# Altium schematic sheet 售烟机上限位电路板.SchDoc
size A4
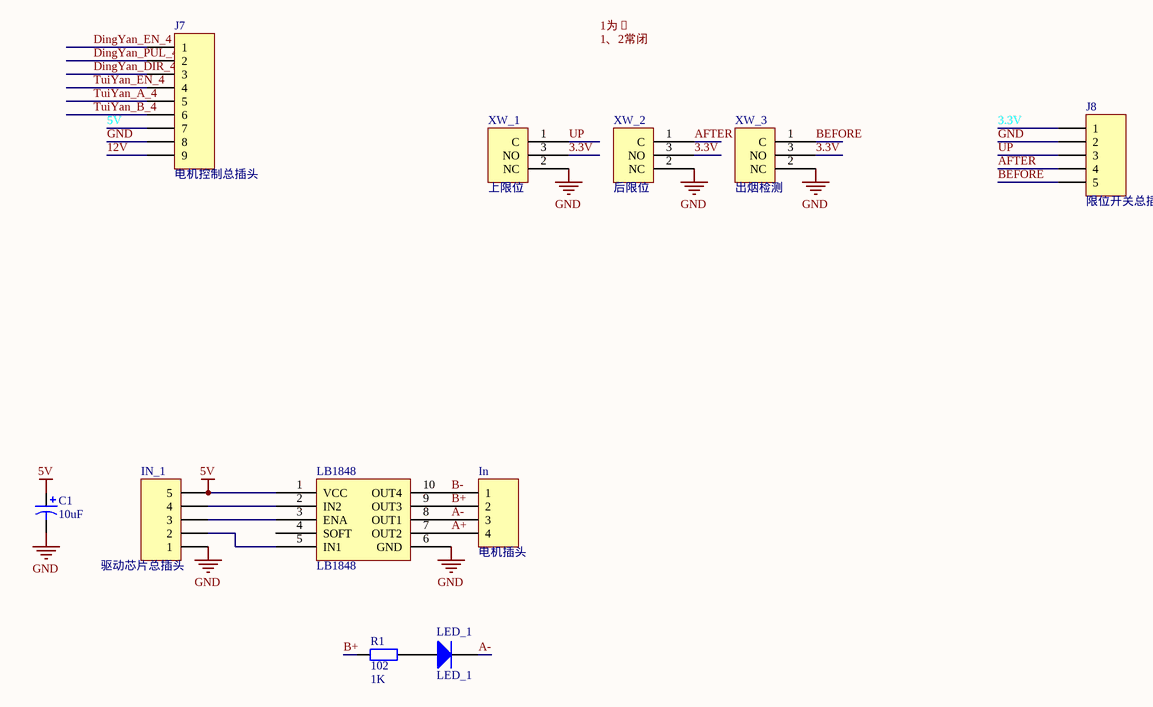
[diagram p0: 售烟机上限位电路板.SchDoc]

## Parts
C1  value 10uF  [有极性电容]  (hidden comment: 106C)
In  电机插头  [间距1.0mm软排线底座]
IN_1  驱动芯片总插头  [HDR1X5]
J7  电机控制总插头  [HDR1X9]
J8  限位开关总插头  [HDR1X5]
LB1848  LB1848  [LB1848]
LED_1  LED_1  [0805]
R1  102  value 1K  [0805]
XW_1  上限位
XW_2  后限位
XW_3  出烟检测

## Nets
5V: C1.1 IN_1.5 J7.7 LB1848.1(VCC)
GND: C1.2 IN_1.1 J7.8 J8.2 LB1848.6(GND) XW_1.2(NC) XW_2.2(NC) XW_3.2(NC)
3.3V: J8.1 XW_1.3(NO) XW_2.3(NO) XW_3.3(NO)
12V: J7.9
A+: In.4 LB1848.7(OUT2)
A-: In.3 LB1848.8(OUT1) LED_1.2(K)
AFTER: J8.4 XW_2.1(C)
B+: In.2 LB1848.9(OUT3) R1.1
B-: In.1 LB1848.10(OUT4)
BEFORE: J8.5 XW_3.1(C)
DingYan_DIR_4: J7.3
DingYan_EN_4: J7.1
DingYan_PUL_4: J7.2
TuiYan_A_4: J7.5
TuiYan_B_4: J7.6
TuiYan_EN_4: J7.4
UP: J8.3 XW_1.1(C)
NetIN_1_2: IN_1.2 LB1848.5(IN1)
NetIN_1_3: IN_1.3 LB1848.3(ENA)
NetIN_1_4: IN_1.4 LB1848.2(IN2)
NetLED_1_1: LED_1.1(A) R1.2

Not connected (* = marked no-connect by the designer): LB1848 4(SOFT)

## Notes on the sheet
- Labels drawn without touching a wire or pin: 1、2常闭, 1为�

## Library data of the parts
C1 = Cap Pol1: Polarized Capacitor (Radial); Published: 8-Jun-2000; LatestRevisionDate: 17-Jul-2002; LatestRevisionNote: Re-released for DXP Platform.; PackageReference: RB7.6-15; Publisher: Altium Limited
In = MHDR1X4: Header, 4-Pin; LatestRevisionDate: 17-Jul-2002; LatestRevisionNote: Re-released for DXP Platform.; Publisher: Altium Limited
IN_1 J8 = Header 5: Header, 5-Pin; LatestRevisionDate: 17-Jul-2002; LatestRevisionNote: Re-released for DXP Platform.; Publisher: Altium Limited
J7 = Header 9: Header, 9-Pin; LatestRevisionDate: 17-Jul-2002; LatestRevisionNote: Re-released for DXP Platform.; Publisher: Altium Limited
LED_1 = Diode: Default Diode; Published: 8-Jun-2000; LatestRevisionDate: 17-Jul-2002; LatestRevisionNote: Re-released for DXP Platform.; PackageDocument: Sep-1996; PackageReference: SMC; Publisher: Altium Limited; Code_JEDEC: DO-214-AB
R1 = Res2: Resistor; Published: 8-Jun-2000; LatestRevisionDate: 17-Jul-2002; LatestRevisionNote: Re-released for DXP Platform.; PackageReference: AXIAL-0.4; Publisher: Altium Limited
XW_1-XW_3 = 限位开关